# Altium schematic sheet TPA_MONO.SchDoc
size A4; SheetNumber: 7; SheetTotal: 8
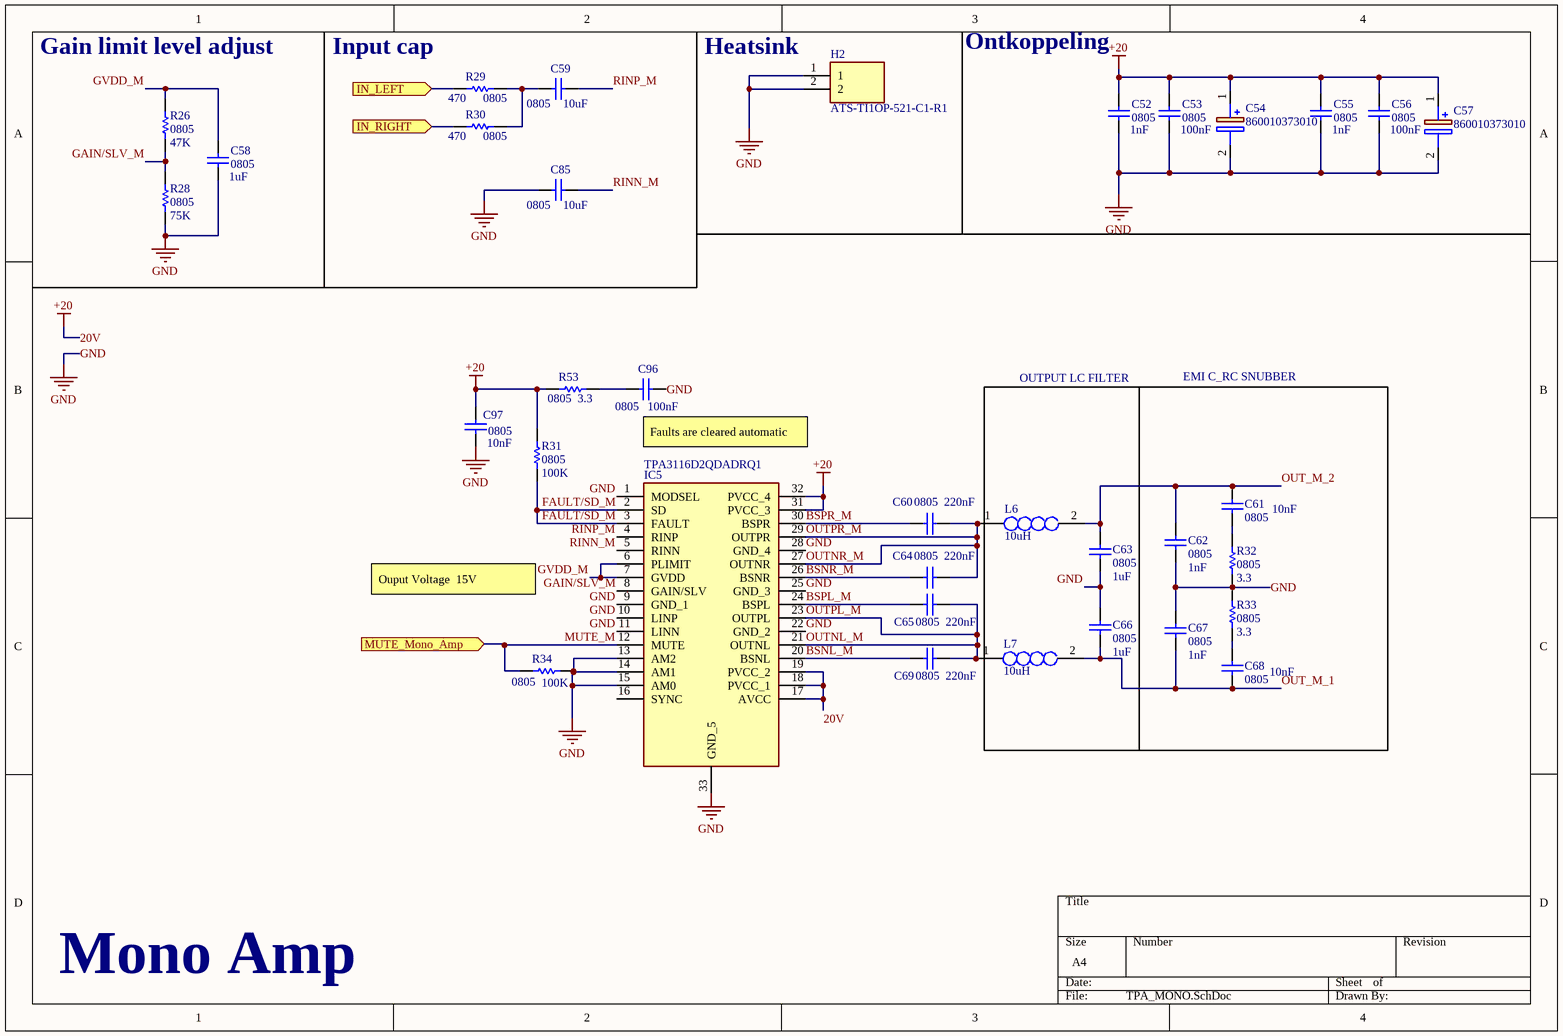
[diagram p0: TPA_MONO.SchDoc]

## Parts
C52  0805  value 1nF  [6-0805_N]
C53  0805  value 100nF  [6-0805_N]
C54  860010373010  [CAPPRD250W52D630H1250]
C55  0805  value 1nF  [6-0805_N]
C56  0805  value 100nF  [6-0805_N]
C57  860010373010  [CAPPRD250W52D630H1250]
C58  0805  value 1uF  [6-0805_N]
C59  0805  value 10uF  [6-0805_N]
C60  0805  value 220nF  [6-0805_N]
C61  0805  value 10nF  [6-0805_N]
C62  0805  value 1nF  [6-0805_N]
C63  0805  value 1uF  [6-0805_N]
C64  0805  value 220nF  [6-0805_N]
C65  0805  value 220nF  [6-0805_N]
C66  0805  value 1uF  [6-0805_N]
C67  0805  value 1nF  [6-0805_N]
C68  0805  value 10nF  [6-0805_N]
C69  0805  value 220nF  [6-0805_N]
C85  0805  value 10uF  [6-0805_N]
C96  0805  value 100nF  [6-0805_N]
C97  0805  value 10nF  [6-0805_N]
H2  ATS-TI1OP-521-C1-R1  [ATSTI1OP521C1R1]
IC5  TPA3116D2QDADRQ1  [SOP65P810X120-33N]
L6  10uH  [INDPM110100X400N]
L7  10uH  [INDPM110100X400N]
R26  0805  value 47K  [6-0805_N]
R28  0805  value 75K  [6-0805_N]
R29  0805  value 470  [6-0805_N]
R30  0805  value 470  [6-0805_N]
R31  0805  value 100K  [6-0805_N]
R32  0805  value 3.3  [6-0805_N]
R33  0805  value 3.3  [6-0805_N]
R34  0805  value 100K  [6-0805_N]
R53  0805  value 3.3  [6-0805_N]

## Blocks framed on the sheet
OUTPUT LC FILTER: C63 C66 L6 L7
EMI C_RC SNUBBER: C61 C62 C67 C68 R32 R33

## Ports
IN_LEFT (in, see Main[3B]), IN_RIGHT (in, see Main[3B]), MUTE_Mono_Amp (in, see Main[3B], AnalogSwitch[3B])

## Nets
20V: C52.1 C53.1 C54.1(+) C55.1 C56.1 C57.1(+) C97.1 IC5.17(AVCC) IC5.18(PVCC_1) IC5.19(PVCC_2) IC5.31(PVCC_3) IC5.32(PVCC_4) R31.2 R53.2  [also labelled +20]
GND: C52.2 C53.2 C54.2(-) C55.2 C56.2 C57.2(-) C58.2 C62.1 C63.1 C66.2 C67.2 C85.1 C96.2 C97.2 H2.1 H2.2 IC5.1(MODSEL) IC5.9(GND_1) IC5.10(LINP) IC5.11(LINN) IC5.13(AM2) IC5.14(AM1) IC5.15(AM0) IC5.22(GND_2) IC5.25(GND_3) IC5.28(GND_4) IC5.33(GND_5) R28.1 R32.1 R33.2 R34.1
BSNL_M: C69.1 IC5.20(BSNL)
BSNR_M: C64.1 IC5.26(BSNR)
BSPL_M: C65.1 IC5.24(BSPL)
BSPR_M: C60.1 IC5.30(BSPR)
FAULT/SD_M: IC5.2(SD) IC5.3(FAULT) R31.1
GAIN/SLV_M: IC5.8(GAIN/SLV) R26.1 R28.2
GVDD_M: C58.1 IC5.6(PLIMIT) IC5.7(GVDD) R26.2
IN_LEFT: R29.2 ; port IN_LEFT
IN_RIGHT: R30.2 ; port IN_RIGHT
MUTE_M: IC5.12(MUTE) R34.2 ; port MUTE_Mono_Amp
OUT_M_1: C66.1 C67.1 C68.1 L7.2
OUT_M_2: C61.2 C62.2 C63.2 L6.2
OUTNL_M: C65.2 C69.2 IC5.21(OUTNL) IC5.23(OUTPL) L7.1  [also labelled OUTPL_M]
OUTNR_M: C60.2 C64.2 IC5.27(OUTNR) IC5.29(OUTPR) L6.1  [also labelled OUTPR_M]
RINN_M: C85.2 IC5.5(RINN)
RINP_M: C59.2 IC5.4(RINP)
NetC59_1: C59.1 R29.1 R30.1
NetC61_1: C61.1 R32.2
NetC68_2: C68.2 R33.1
NetC96_1: C96.1 R53.1

Not connected (* = marked no-connect by the designer): IC5 16(SYNC)

## Notes on the sheet
- (near R26) Gain limit level adjust
- (near R29) Input cap
- (near H2) Heatsink
- Ontkoppeling
- (near C96) Faults are cleared automatic
- Ouput Voltage  15V
- Mono Amp

## Library data of the parts
C52 C53 C55 C56 C58-C69 C85 C96 C97 = Cap: Capacitor; Published: 8-Jun-2000; LatestRevisionDate: 17-Jul-2002; LatestRevisionNote: Re-released for DXP Platform.; PackageReference: RAD-0.3; Publisher: Altium Limited; PackageDescription: Radial Cap, Thru-Hole; 2 Leads; 0.3 in Pin Spacing
C54 C57 = 860010373010: Capacitor Polarised; Manufacturer_Name: Wurth Elektronik; Datasheet Link: https://ms.componentsearchengine.com/Datasheets/2/860010373010.pdf; Height: 12.5mm; Manufacturer_Part_Number: 860010373010; Mouser Part Number: 710-860010373010; Mouser Price/Stock: https://www.mouser.com/Search/Refine.aspx?Keyword=710-860010373010
H2 = ATS-TI1OP-521-C1-R1: Hardware; Manufacturer_Name: ADVANCED THERMAL SOLUTIONS; Datasheet Link: https://media.digikey.com/pdf/Data%20Sheets/Advanced%20Thermal%20Solutions%20PDFs/ATS-TI10P-521-C1-R1.pdf; Height: 28mm; Manufacturer_Part_Number: ATS-TI1OP-521-C1-R1; Mouser Part Number: 984-ATS-TI1OP521C1R1; Mouser Price/Stock: https://www.mouser.co.uk/ProductDetail/Advanced-Thermal-Solutions/ATS-TI1OP-521-C1-R1?qs=MLItCLRbWsx43HjcCreTeQ%3D%3D; Arrow Part Number: ATS-TI1OP-521-C1-R1; Arrow Price/Stock: https://www.arrow.com/en/products/ats-ti1op-521-c1-r1/advanced-thermal-solutions?region=europe
IC5 = TPA3116D2QDADRQ1: Integrated Circuit; Manufacturer_Name: Texas Instruments; Datasheet Link: http://www.ti.com/lit/gpn/tpa3116d2-q1; Height: 1.2mm; Manufacturer_Part_Number: TPA3116D2QDADRQ1; Mouser Part Number: 595-TPA3116D2QDADRQ1; Mouser Price/Stock: https://www.mouser.co.uk/ProductDetail/Texas-Instruments/TPA3116D2QDADRQ1?qs=UPLqB4C8V4HphPtdRa3LzQ%3D%3D; Arrow Part Number: TPA3116D2QDADRQ1; Arrow Price/Stock: https://www.arrow.com/en/products/tpa3116d2qdadrq1/texas-instruments?region=nac
L6 L7 = SRP1038A-4R7M: Inductor; Manufacturer_Name: Bourns; Datasheet Link: http://uk.rs-online.com/web/p/products/8193346; Height: 4mm; Manufacturer_Part_Number: SRP1038A-4R7M; Mouser Part Number: 652-SRP1038A-4R7M; Mouser Price/Stock: https://www.mouser.co.uk/ProductDetail/Bourns/SRP1038A-4R7M/?qs=7z%252BmIopC6%2FImcvZmY6cLew%3D%3D; Arrow Part Number: SRP1038A-4R7M; Arrow Price/Stock: https://www.arrow.com/en/products/srp1038a-4r7m/bourns?region=nac
R26 R28-R34 R53 = Res1: Resistor; Published: 8-Jun-2000; LatestRevisionDate: 17-Jul-2002; LatestRevisionNote: Re-released for DXP Platform.; PackageReference: AXIAL-0.3; Publisher: Altium Limited; PackageDescription: Axial Device, Thru-Hole; 2 Leads; 0.3 in Pin Spacing